# EAGLE schematic Nanopi_sheild (EAGLE 9.4.2)
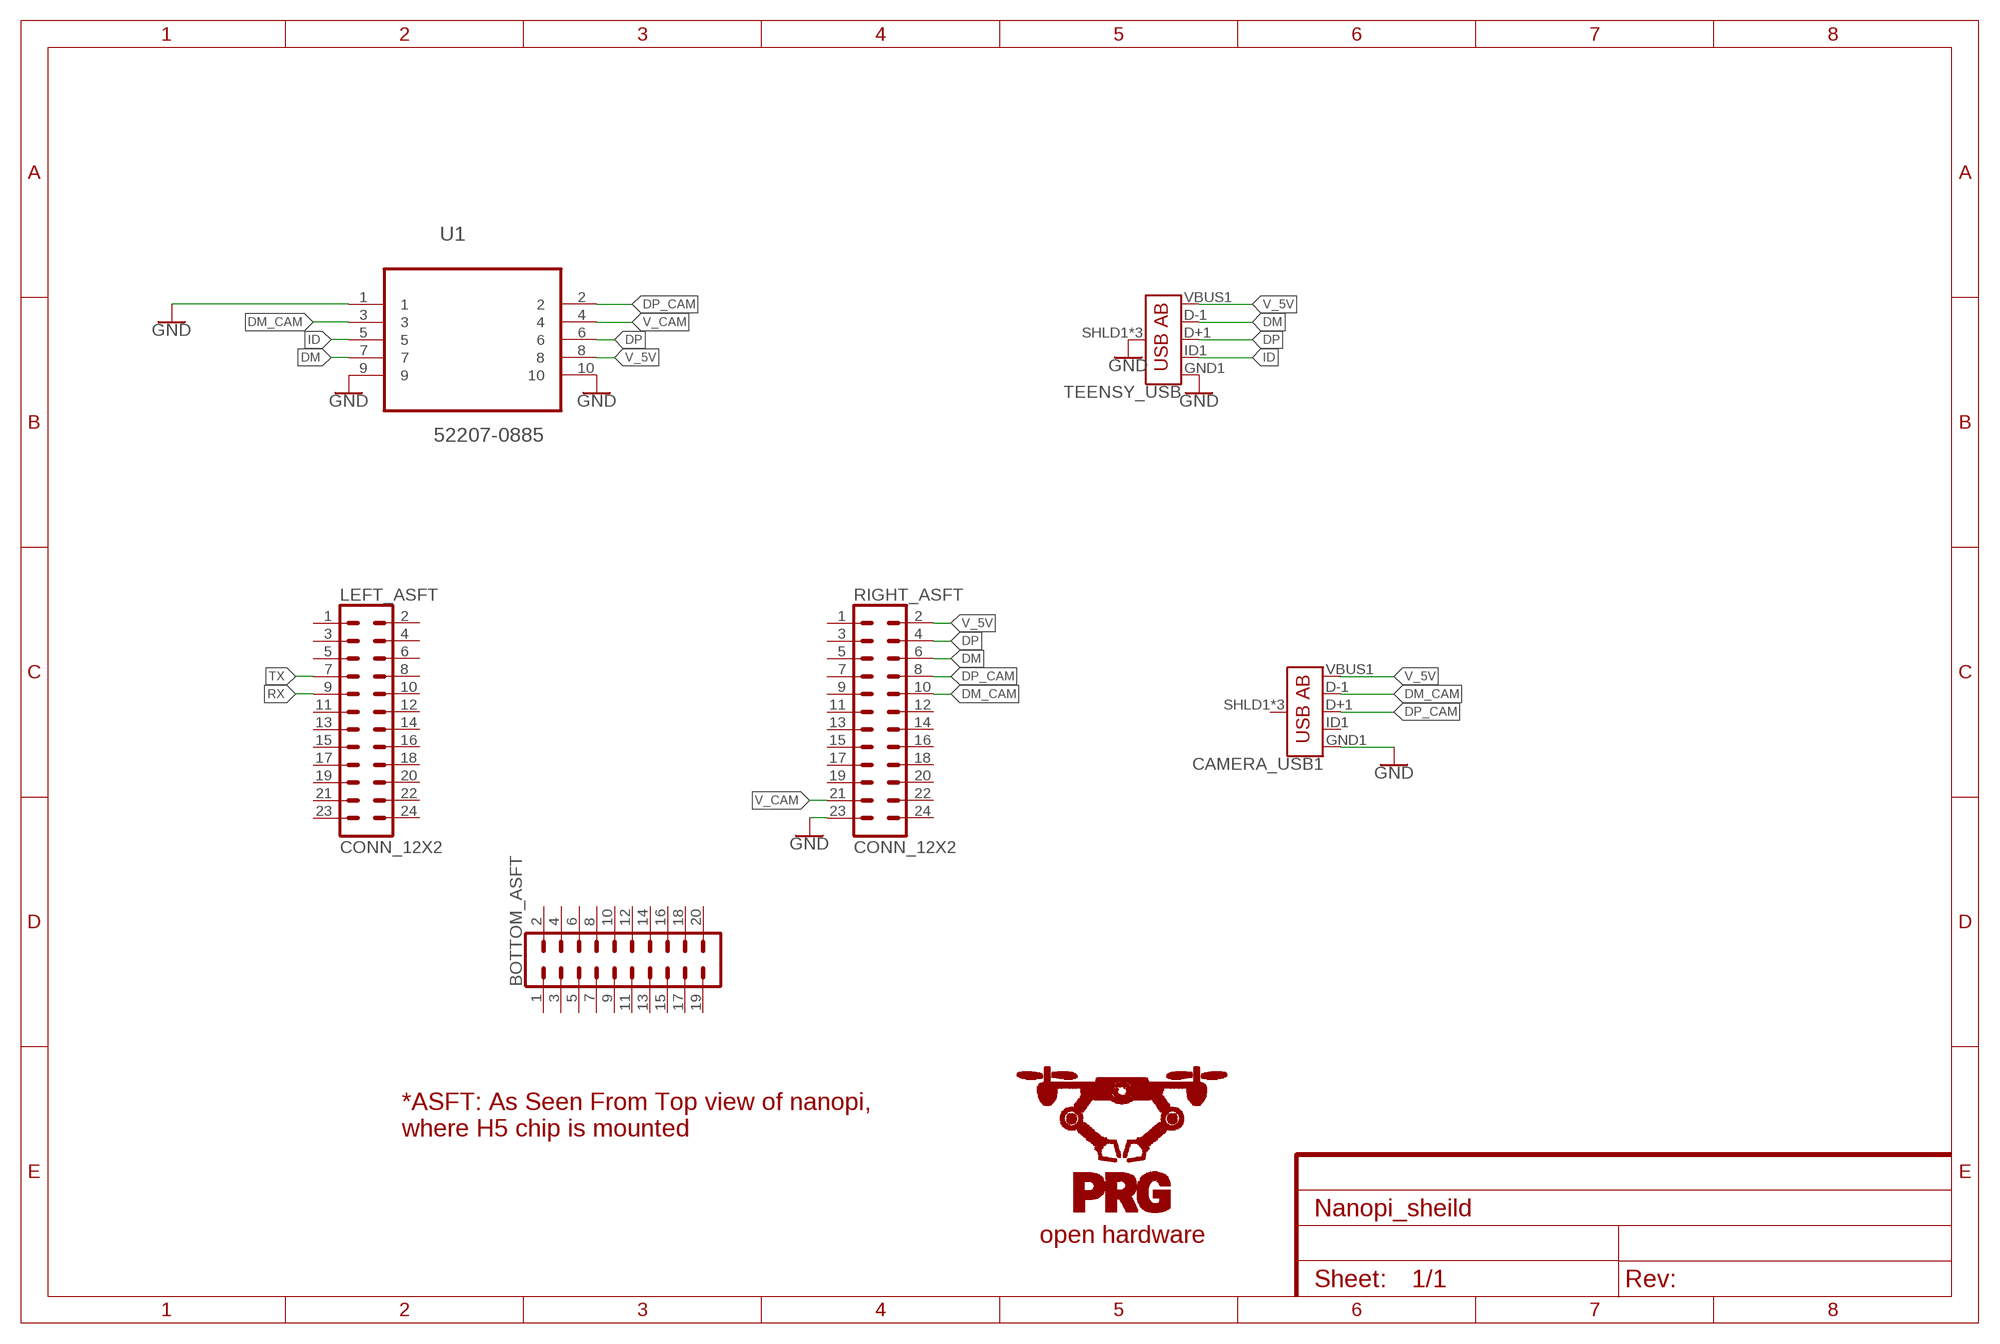
[diagram p0: schematic, sheet 1]

## Parts
BOTTOM_ASFT  CONN_10X2  [2X10]
CAMERA_USB1  USB_AB_SMT  [USB-AB-MICRO-SMD]
LEFT_ASFT  CONN_12X2  [2X12]
RIGHT_ASFT  CONN_12X2  [2X12]
TEENSY_USB  USB_AB_SMT  [USB-AB-MICRO-SMD]
U1  52207-0885  [MOLEX_52207-0885]

## Nets
DM: RIGHT_ASFT.6 TEENSY_USB.D-1(D-) U1.7
DM_CAM: CAMERA_USB1.D-1(D-) RIGHT_ASFT.10 U1.3
DP: RIGHT_ASFT.4 TEENSY_USB.D+1(D+) U1.6
DP_CAM: CAMERA_USB1.D+1(D+) RIGHT_ASFT.8 U1.2
GND: CAMERA_USB1.GND1(GND) RIGHT_ASFT.23 TEENSY_USB.GND1(GND) TEENSY_USB.SHLD1(SHIELD) TEENSY_USB.SHLD2(SHIELD) TEENSY_USB.SHLD3(SHIELD) U1.1 U1.9 U1.10
ID: TEENSY_USB.ID1(USBID) U1.5
RX: LEFT_ASFT.9
TX: LEFT_ASFT.7
V_5V: CAMERA_USB1.VBUS1(VBUS) RIGHT_ASFT.2 TEENSY_USB.VBUS1(VBUS) U1.8
V_CAM: RIGHT_ASFT.21 U1.4
Unconnected: BOTTOM_ASFT.1 BOTTOM_ASFT.2 BOTTOM_ASFT.3 BOTTOM_ASFT.4 BOTTOM_ASFT.5 BOTTOM_ASFT.6 BOTTOM_ASFT.7 BOTTOM_ASFT.8 BOTTOM_ASFT.9 BOTTOM_ASFT.10 BOTTOM_ASFT.11 BOTTOM_ASFT.12 BOTTOM_ASFT.13 BOTTOM_ASFT.14 BOTTOM_ASFT.15 BOTTOM_ASFT.16 BOTTOM_ASFT.17 BOTTOM_ASFT.18 BOTTOM_ASFT.19 BOTTOM_ASFT.20 CAMERA_USB1.ID1(USBID) CAMERA_USB1.SHLD1(SHIELD) CAMERA_USB1.SHLD2(SHIELD) CAMERA_USB1.SHLD3(SHIELD) LEFT_ASFT.1 LEFT_ASFT.2 LEFT_ASFT.3 LEFT_ASFT.4 LEFT_ASFT.5 LEFT_ASFT.6 LEFT_ASFT.8 LEFT_ASFT.10 LEFT_ASFT.11 LEFT_ASFT.12 LEFT_ASFT.13 LEFT_ASFT.14 LEFT_ASFT.15 LEFT_ASFT.16 LEFT_ASFT.17 LEFT_ASFT.18 LEFT_ASFT.19 LEFT_ASFT.20 LEFT_ASFT.21 LEFT_ASFT.22 LEFT_ASFT.23 LEFT_ASFT.24 RIGHT_ASFT.1 RIGHT_ASFT.3 RIGHT_ASFT.5 RIGHT_ASFT.7 RIGHT_ASFT.9 RIGHT_ASFT.11 RIGHT_ASFT.12 RIGHT_ASFT.13 RIGHT_ASFT.14 RIGHT_ASFT.15 RIGHT_ASFT.16 RIGHT_ASFT.17 RIGHT_ASFT.18 RIGHT_ASFT.19 RIGHT_ASFT.20 RIGHT_ASFT.22 RIGHT_ASFT.24

## Notes on the sheet
- *ASFT: As Seen From Top view of nanopi,
  where H5 chip is mounted
- open hardware

## Library data of the parts
BOTTOM_ASFT = SparkFun-Connectors:CONN_10X2: Multi connection point. Often used as Generic Header-pin footprint for 0.1 inch spaced/style header connections On any of the 0.1 inch spaced packages, you can populate with these: Break Away Headers - Straight <https://www.sparkfun.com/products/116> (PRT-00116) Break Away Male Headers - Right Angle <https://www.sparkfun.com/products/553> (PRT-00553) Female Headers <https://www.sparkfun.com/products/115> (PRT-00115) Break Away Headers - Machine Pin <https://www.sparkfun.com/products/117> (PRT-00117) Break Away Female Headers - Swiss Machine Pin <https://www.sparkfun.com/products/743> (PRT-00743) Special note about the "SPECIAL" package: This was SPECIALLY designed to be used with our Graphic LCD Backpack. Be sure you want to use this! It is not only staggered on each line of header holes, but IT IS ALSO offset of the center point of the top and bottom lines by 5 mil. This causes the headers to lock into place on the "standard" footprint on the LCD screen. The extra squares on the tdocu layer are there simply to reference other pins (if you were to actually populate a longer header than ten long - this is what we do with the backpacks).
CAMERA_USB1 TEENSY_USB = SparkFun-Connectors:USB_AB: USB Type AB Micro Connector OTG-compatible. 5 pins, 3 shield pins SparkFun Products: IOIO-OTG <https://www.sparkfun.com/products/13613> SparkFun SAMD21 Mini Breakout <https://www.sparkfun.com/products/13664>; PROD_ID: CONN-11794
LEFT_ASFT RIGHT_ASFT = SparkFun-Connectors:CONN_12X2: Multi connection point. Often used as Generic Header-pin footprint for 0.1 inch spaced/style header connections On any of the 0.1 inch spaced packages, you can populate with these: Break Away Headers - Straight <https://www.sparkfun.com/products/116> (PRT-00116) Break Away Male Headers - Right Angle <https://www.sparkfun.com/products/553> (PRT-00553) Female Headers <https://www.sparkfun.com/products/115> (PRT-00115) Break Away Headers - Machine Pin <https://www.sparkfun.com/products/117> (PRT-00117) Break Away Female Headers - Swiss Machine Pin <https://www.sparkfun.com/products/743> (PRT-00743)
U1 = Molex_By_element14_Batch_1:52207-0885: SOCKET FPC, SMT, 1MM, 8 WAY; MPN: 52207-0885; OC_FARNELL: -; OC_NEWARK: 07P8553; PACKAGE: SOCKET FPC, SMT, 1MM, 8 WAY; SUPPLIER: Molex